# EasyEDA schematic SCH_Macropad.json
TITLE: Sheet_1; REV: 1.0; Date: 2025-12-04; Sheet: 1/1; Drawn By: shaur1021; Company: Your Company
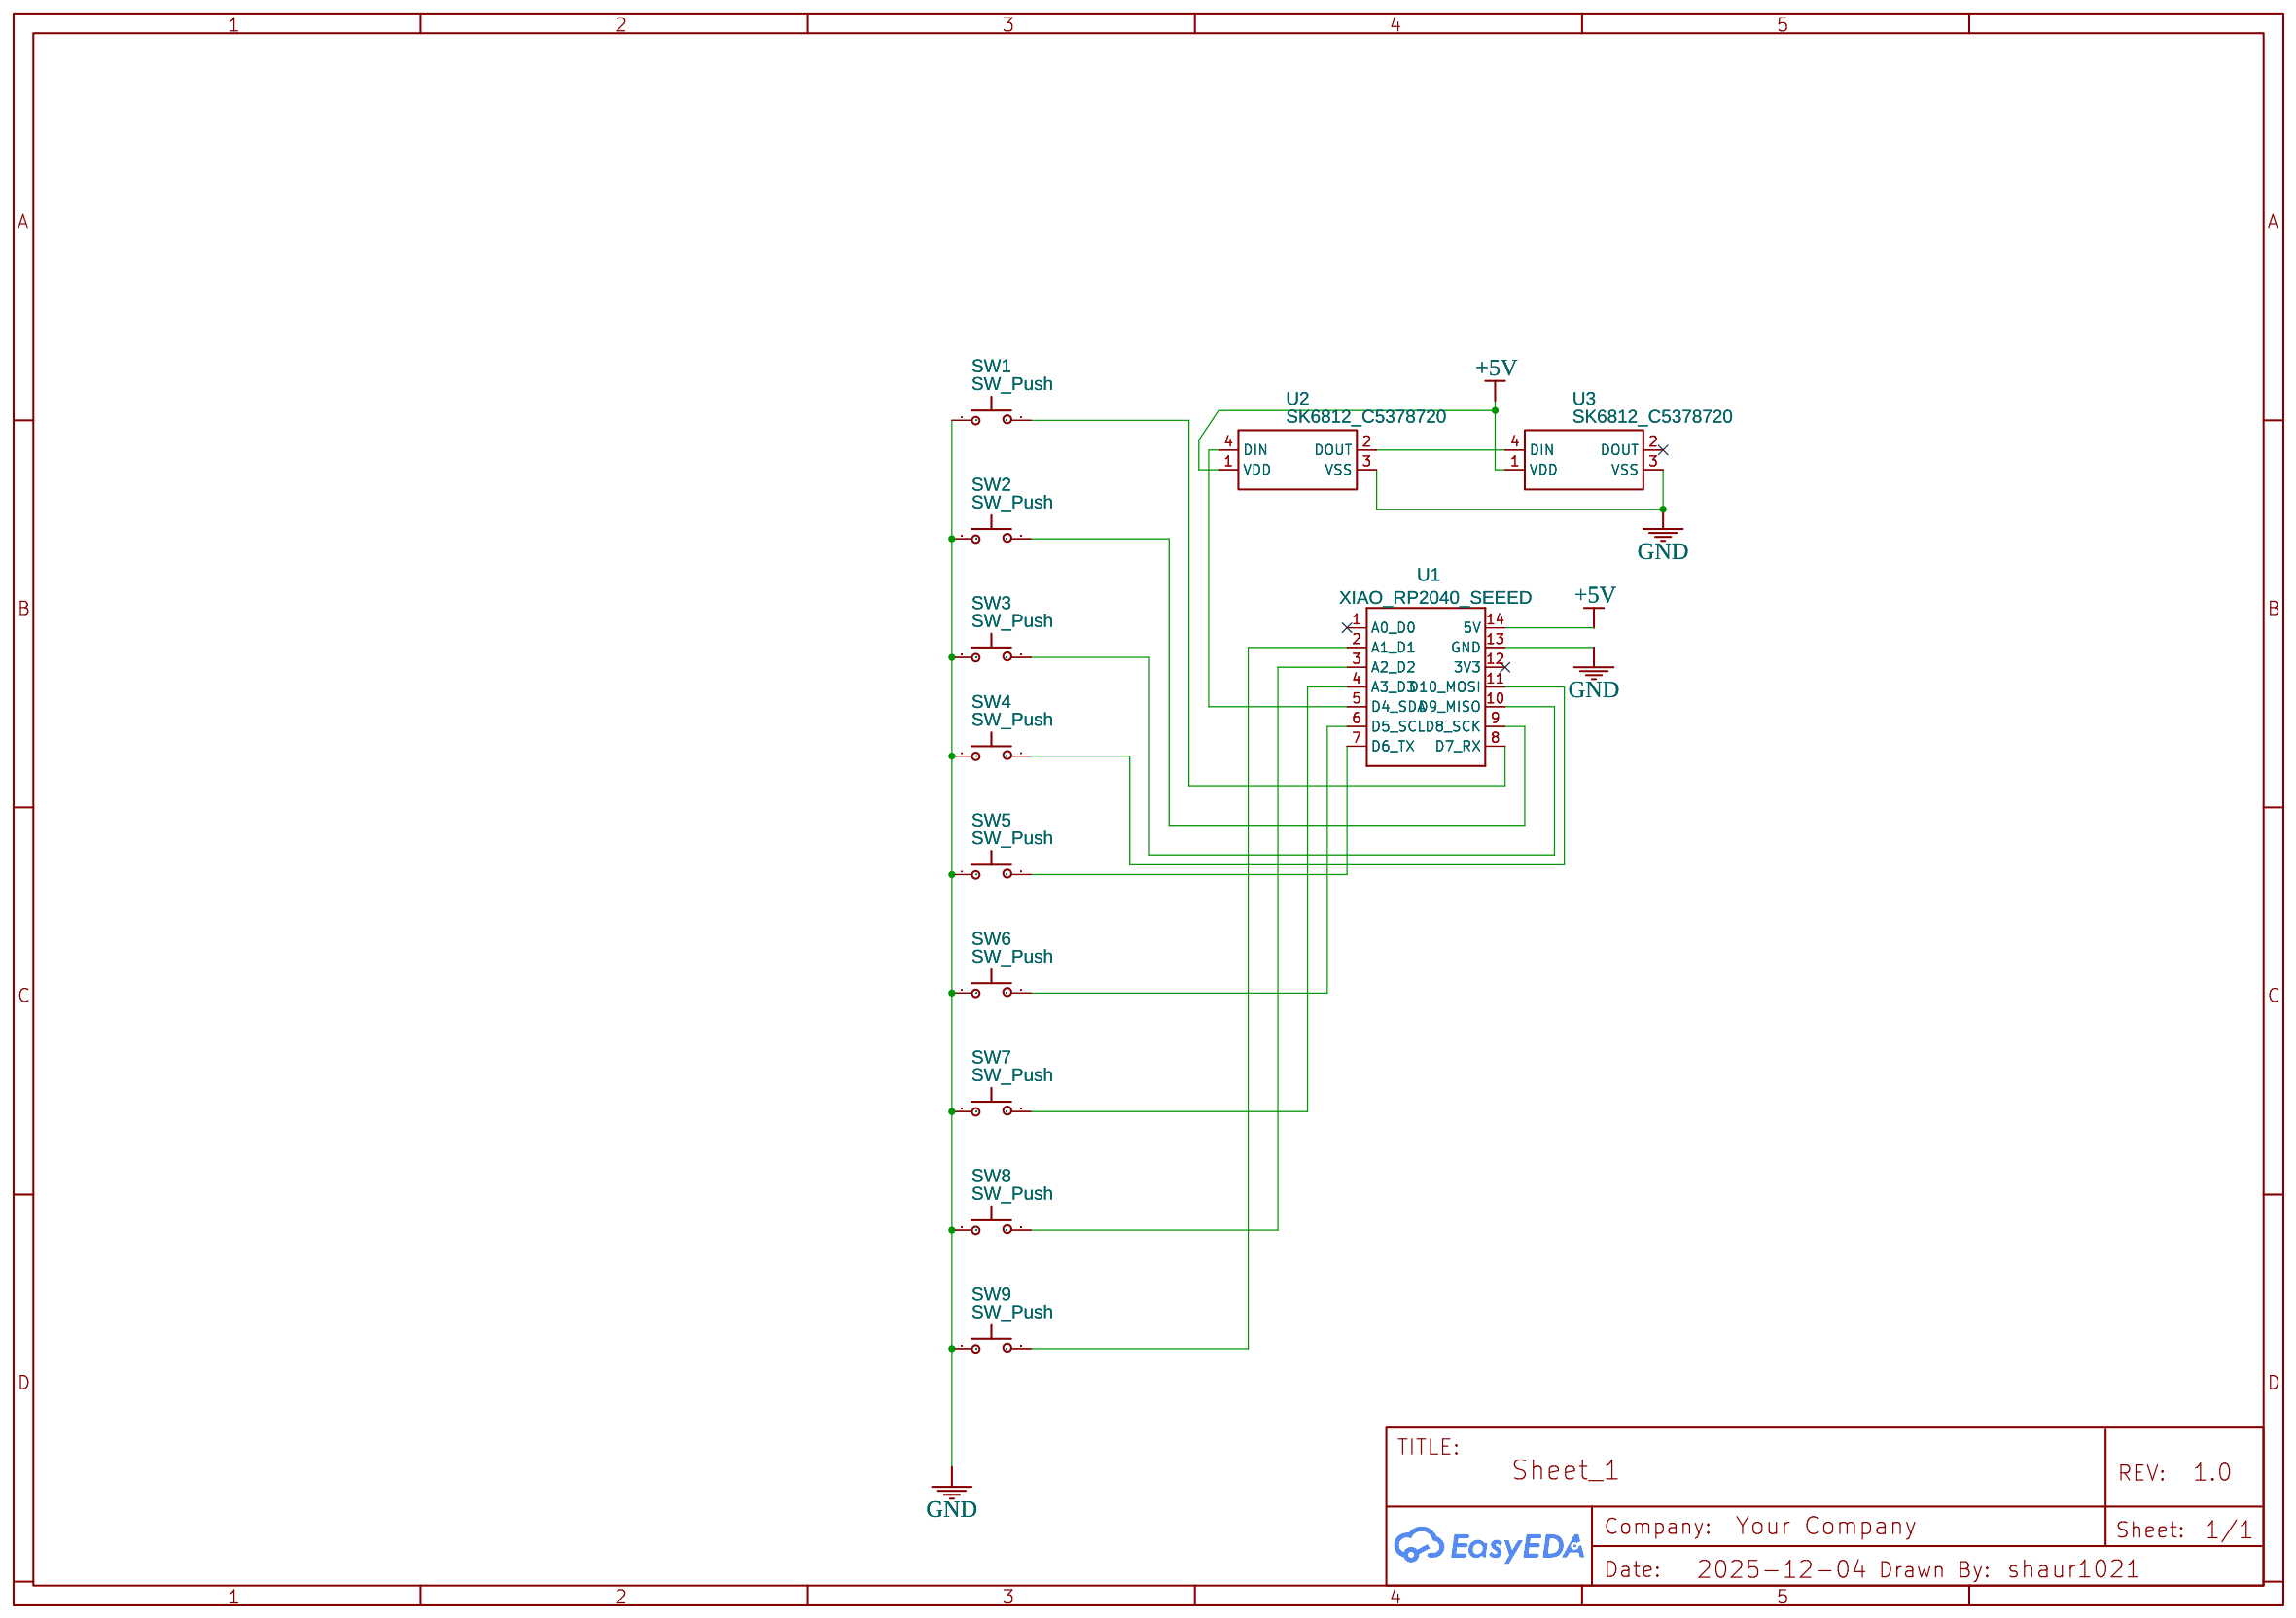
[diagram p0: schematic sheet]

## Parts
SW1  SW_Push  [SW_CHERRY_MX_1.00U_PCB]
SW2  SW_Push  [SW_CHERRY_MX_1.00U_PCB]
SW3  SW_Push  [SW_CHERRY_MX_1.00U_PCB]
SW4  SW_Push  [SW_CHERRY_MX_1.00U_PCB]
SW5  SW_Push  [SW_CHERRY_MX_1.00U_PCB]
SW6  SW_Push  [SW_CHERRY_MX_1.00U_PCB]
SW7  SW_Push  [SW_CHERRY_MX_1.00U_PCB]
SW8  SW_Push  [SW_CHERRY_MX_1.00U_PCB]
SW9  SW_Push  [SW_CHERRY_MX_1.00U_PCB]
U1  XIAO_RP2040_SEEED  [XIAO_RP2040_SEEED]
U2  SK6812_C5378720  [LED-SMD_4P-L5.0-W5.0-LS5.4-TL-1]
U3  SK6812_C5378720  [LED-SMD_4P-L5.0-W5.0-LS5.4-TL-1]

## Library data of the parts
SW1-SW9 = SW_Push: Contributor: KiCAD; license: https://www.gnu.org/licenses/lgpl-2.1.html
U1 = XIAO_RP2040_SEEED: Contributor: jeen
U2 U3 = SK6812_C5378720: Supplier: LCSC; Supplier Part: C5378720; Manufacturer: 欧思科光电; Manufacturer Part: SK6812; JLCPCB Part Class: Extended Part; Contributor: lcsc

## Nets
+5V: U1.14(5V) U2.1(VDD) U3.1(VDD)
GND: SW1.1 SW2.1 SW3.1 SW4.1 SW5.1 SW6.1 SW7.1 SW8.1 SW9.1 U1.13(GND) U2.3(VSS) U3.3(VSS)
Net-(SW1-2): SW1.2 U1.8(D7_RX)
Net-(SW2-2): SW2.2 U1.9(D8_SCK)
Net-(SW3-2): SW3.2 U1.10(D9_MISO)
Net-(SW4-2): SW4.2 U1.11(D10_MOSI)
Net-(SW5-2): SW5.2 U1.7(D6_TX)
Net-(SW6-2): SW6.2 U1.6(D5_SCL)
Net-(SW7-2): SW7.2 U1.4(A3_D3)
Net-(SW8-2): SW8.2 U1.3(A2_D2)
Net-(SW9-2): SW9.2 U1.2(A1_D1)
Net-(U1-5): U1.5(D4_SDA) U2.4(DIN)
Net-(U2-2): U2.2(DOUT) U3.4(DIN)

Not connected (* = marked no-connect by the designer): U1 1(A0_D0)* 12(3V3)*; U3 2(DOUT)*
